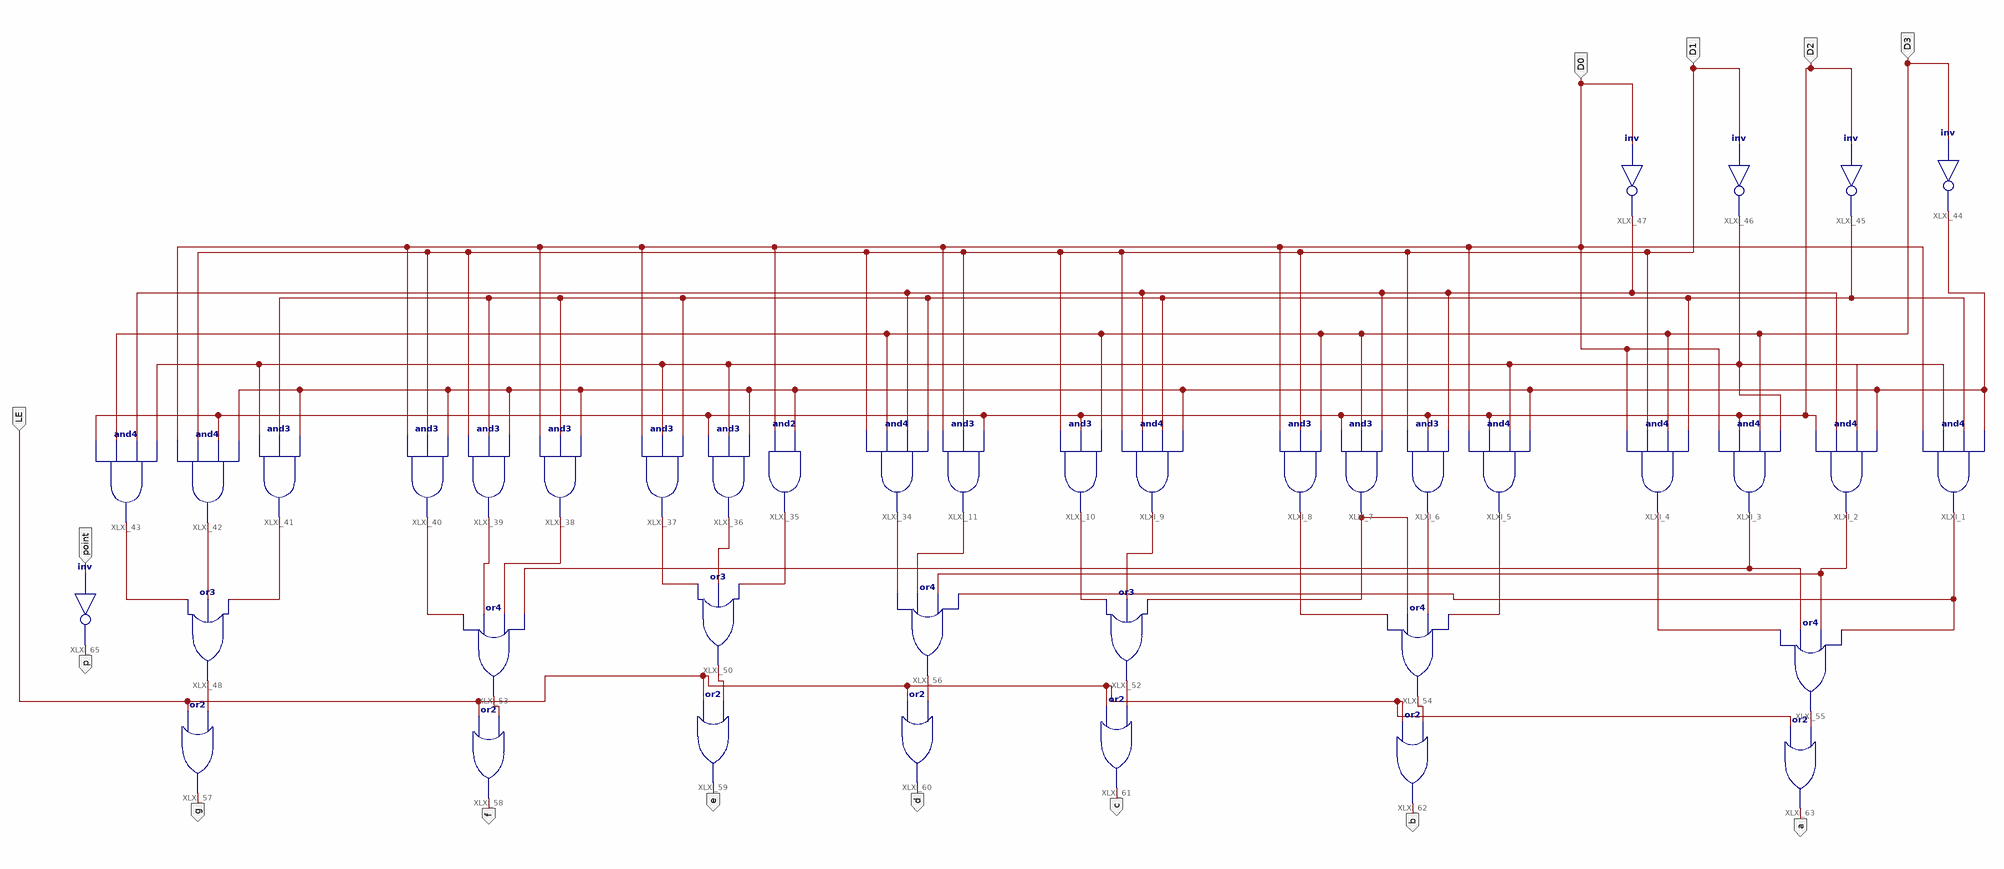
[diagram p0: schematic sheet 1]
// Xilinx ISE schematic MyMC14495.sch (kintex7) as structural Verilog: 40 symbols, 14 ports
module MyMC14495 (
  input  D1,
  input  D3,
  input  D2,
  input  D0,
  input  LE,
  input  point,
  output g,
  output f,
  output e,
  output d,
  output c,
  output b,
  output a,
  output p
);

  wire XLXN_9, XLXN_10, XLXN_11, XLXN_12, XLXN_21, XLXN_22, XLXN_23, XLXN_24, XLXN_26, XLXN_27, XLXN_28,
       XLXN_29, XLXN_30, XLXN_31, XLXN_32, XLXN_33, XLXN_34, XLXN_35, XLXN_36, XLXN_37, XLXN_38, XLXN_39,
       XLXN_40, XLXN_41, XLXN_42, XLXN_43, XLXN_44, XLXN_45, XLXN_46, XLXN_47, XLXN_48, XLXN_49;

  and XLXI_1 (XLXN_32, D0, XLXN_11, XLXN_10, XLXN_9);
  and XLXI_2 (XLXN_33, D2, XLXN_12, XLXN_11, XLXN_9);
  and XLXI_3 (XLXN_21, D0, D2, D3, XLXN_11);
  and XLXI_4 (XLXN_22, D0, D1, D3, XLXN_10);
  and XLXI_5 (XLXN_23, D0, D2, XLXN_11, XLXN_9);
  and XLXI_6 (XLXN_24, D1, D2, XLXN_12);
  and XLXI_7 (XLXN_26, D2, D3, XLXN_12);
  and XLXI_8 (XLXN_27, D0, D1, D3);
  and XLXI_9 (XLXN_28, D1, XLXN_12, XLXN_10, XLXN_9);
  and XLXI_10 (XLXN_29, D1, D2, D3);
  and XLXI_11 (XLXN_31, D0, D1, D2);
  and XLXI_34 (XLXN_30, D1, D3, XLXN_12, XLXN_10);
  and XLXI_35 (XLXN_34, D0, XLXN_9);
  and XLXI_36 (XLXN_35, D2, XLXN_11, XLXN_9);
  and XLXI_37 (XLXN_36, D0, XLXN_11, XLXN_10);
  and XLXI_38 (XLXN_37, D0, XLXN_10, XLXN_9);
  and XLXI_39 (XLXN_38, D1, XLXN_10, XLXN_9);
  and XLXI_40 (XLXN_39, D0, D1, XLXN_9);
  and XLXI_41 (XLXN_42, XLXN_11, XLXN_10, XLXN_9);
  and XLXI_42 (XLXN_41, D0, D1, D2, XLXN_9);
  and XLXI_43 (XLXN_40, D2, D3, XLXN_12, XLXN_11);
  or XLXI_48 (XLXN_49, XLXN_40, XLXN_41, XLXN_42);
  or XLXI_50 (XLXN_47, XLXN_36, XLXN_35, XLXN_34);
  or XLXI_52 (XLXN_45, XLXN_29, XLXN_28, XLXN_26);
  or XLXI_53 (XLXN_48, XLXN_39, XLXN_38, XLXN_37, XLXN_21);
  or XLXI_54 (XLXN_44, XLXN_27, XLXN_26, XLXN_24, XLXN_23);
  or XLXI_55 (XLXN_43, XLXN_22, XLXN_21, XLXN_33, XLXN_32);
  or XLXI_56 (XLXN_46, XLXN_30, XLXN_31, XLXN_33, XLXN_32);
  or XLXI_57 (g, LE, XLXN_49);
  or XLXI_58 (f, LE, XLXN_48);
  or XLXI_59 (e, LE, XLXN_47);
  or XLXI_60 (d, LE, XLXN_46);
  or XLXI_61 (c, LE, XLXN_45);
  or XLXI_62 (b, LE, XLXN_44);
  or XLXI_63 (a, LE, XLXN_43);
  not XLXI_44 (XLXN_9, D3);
  not XLXI_45 (XLXN_10, D2);
  not XLXI_46 (XLXN_11, D1);
  not XLXI_47 (XLXN_12, D0);
  not XLXI_65 (p, point);
endmodule
